# Altium project Lora_low_Power.PrjPcb
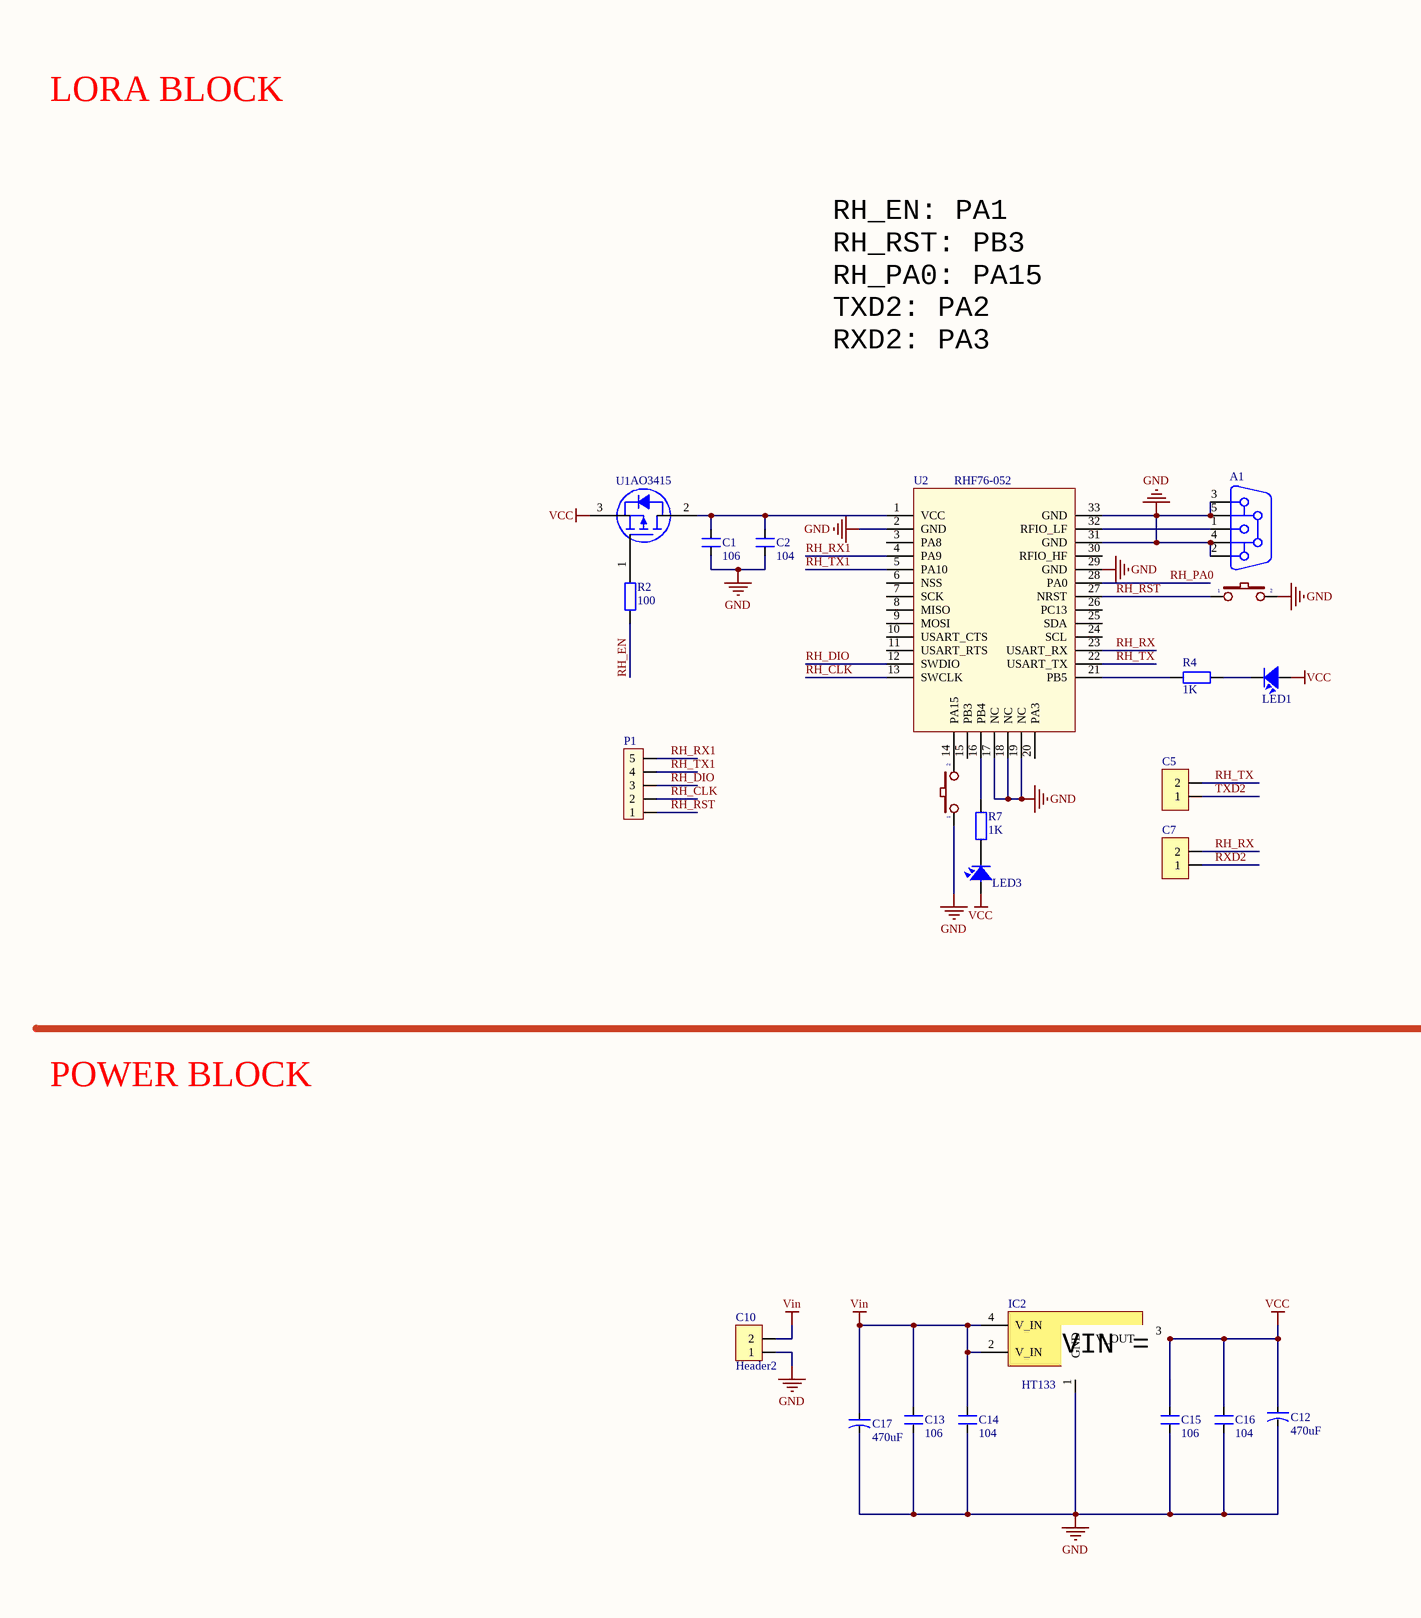
[diagram p0: Sheet2.SchDoc, left]
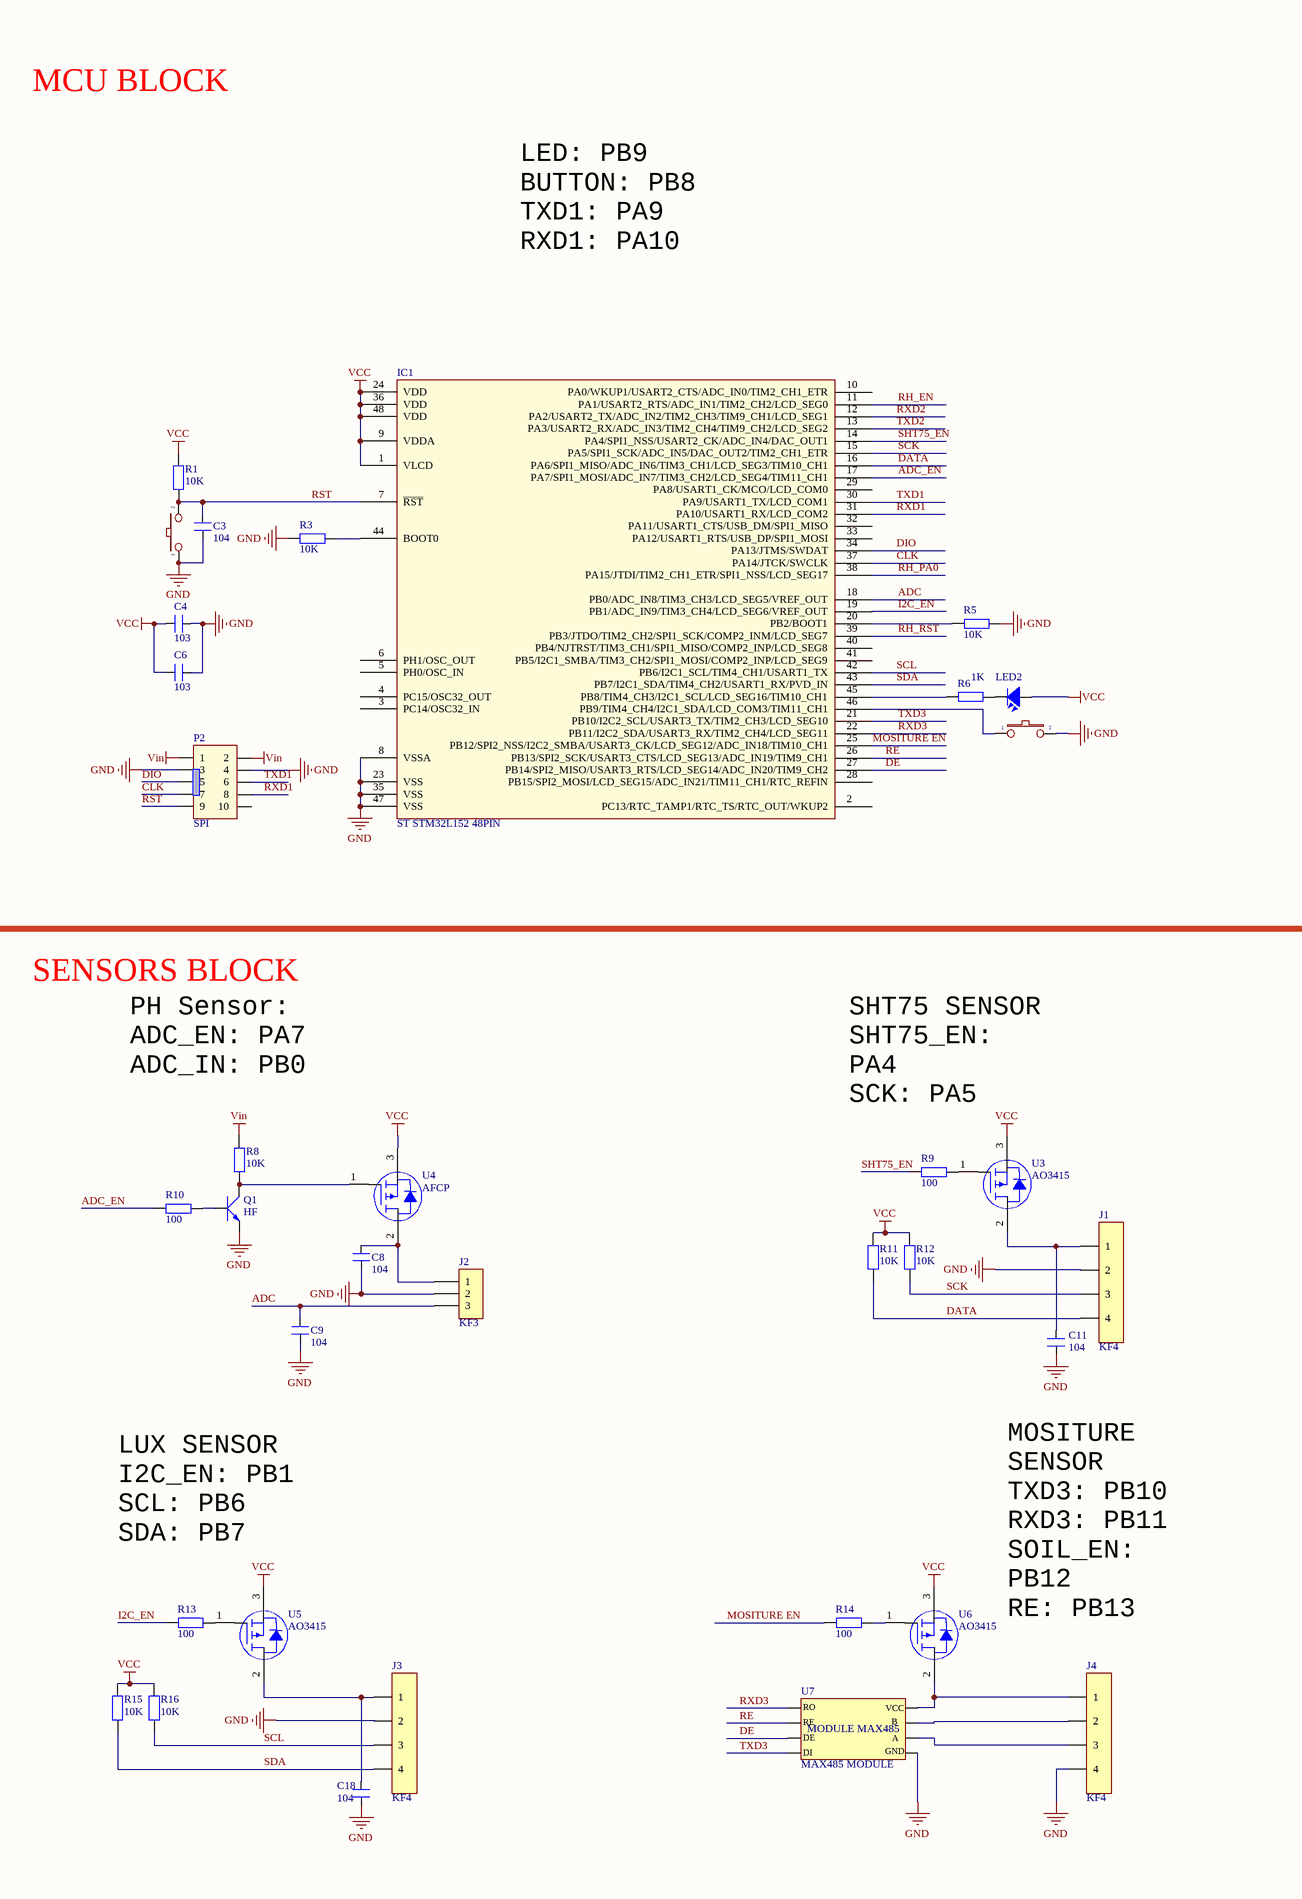
[diagram p1: Sheet2.SchDoc, right]
1 sheet, 58 parts. Net scope: global (net labels, ports and power ports of the same name join across sheets).
Board file: PCB2.PcbDoc

## Sheet Sheet2.SchDoc
size A2

### Parts
A1  (no value)  [SMA-V]
C1  106  [CAP 0805]
C2  104  [CAP 0805]
C3  104  [CAP 0805]
C4  103  [CAP 0805]
C5  JP2  [JP2-CLOSED]  (value not drawn)
C6  103  [CAP 0805]
C7  JP2  [JP2-CLOSED]  (value not drawn)
C8  104  [CAP 0805]
C9  104  [CAP 0805]
C10  Header2  [Header2]
C11  104  [CAP 0805]
C12  470uF  [Tu_Nhom]
C13  106  [CAP 0805]
C14  104  [CAP 0805]
C15  106  [CAP 0805]
C16  104  [CAP 0805]
C17  470uF  [Tu_Nhom]
C18  104  [CAP 0805]
IC1  ST STM32L152 48PIN  [ST LQFP-48 7x7MM]
IC2  HT133  [HT7133]
J1  KF4  [KF4]
J2  KF3  [KF3-5.08T]
J3  KF4  [KF4]
J4  KF4  [KF4]
LED1  LED  [LED 0805]  (value not drawn)
LED2  LED  [Header2]  (value not drawn)
LED3  LED  [LED 0805]  (value not drawn)
P1  JP5  [JP5]  (value not drawn)
P2  SPI  [IDE_2X5]
Q1  HF  [SOT23B]
R1  10K  [RES 0805/2012]
R2  100  [RES 0805/2012]
R3  10K  [RES 0805/2012]
R4  1K  [RES 0805/2012]
R5  10K  [RES 0805/2012]
R6  1K  [RES 0805/2012]
R7  1K  [RES 0805/2012]
R8  10K  [RES 0805/2012]
R9  100  [RES 0805/2012]
R10  100  [RES 0805/2012]
R11  10K  [RES 0805/2012]
R12  10K  [RES 0805/2012]
R13  100  [RES 0805/2012]
R14  100  [RES 0805/2012]
R15  10K  [RES 0805/2012]
R16  10K  [RES 0805/2012]
SW1  LRST  [SW1-SMD]  (value not drawn)
SW2  RST  [Header2]  (value not drawn)
SW3  DFU  [SW1-SMD]  (value not drawn)
SW4  RST  [Header2]  (value not drawn)
U1  AO3415  [SOT23B]
U2  RHF76-052  [RHF76-052]
U3  AO3415  [SOT23B]
U4  AFCP  [SOT23B]
U5  AO3415  [SOT23B]
U6  AO3415  [SOT23B]
U7  MAX485 MODULE  [MODULE MAX485]

### Nets
GND: A1.2 A1.3 A1.4 A1.5 C1.2 C2.1 C3.1 C4.2 C6.2 C8.2 C9.2 C10.1 C11.2 C12.2 C13.2 C14.2 C15.2 C16.2 C17.2 C18.2 IC1.8(VSSA) IC1.23(VSS) IC1.35(VSS) IC1.47(VSS) IC2.1(GND) J1.2 J2.2 J3.2 J4.4 P2.3 P2.4 Q1.1(E) R3.1 R5.2 SW1.2 SW2.1 SW3.1 SW4.2 U2.2(GND) U2.17(NC) U2.18(NC) U2.19(NC) U2.29(GND) U2.31(GND) U2.33(GND) U7.5
VCC: C4.1 C6.1 C12.1 C15.1 C16.1 IC1.1(VLCD) IC1.9(VDDA) IC1.24(VDD) IC1.36(VDD) IC1.48(VDD) IC2.3(V_OUT) LED1.1 LED2.1 LED3.1 R1.2 R11.2 R12.2 R15.2 R16.2 U1.3(S) U3.3(S) U4.3(S) U5.3(S) U6.3(S)
Vin: C10.2 C13.1 C14.1 C17.1 IC2.2(V_IN) IC2.4(V_IN) P2.1 P2.2 R8.2
ADC: C9.1 IC1.18(PB0/ADC_IN8/TIM3_CH3/LCD_SEG5/VREF_OUT) J2.3
ADC_EN: IC1.17(PA7/SPI1_MOSI/ADC_IN7/TIM3_CH2/LCD_SEG4/TIM11_CH1) R10.2
CLK: IC1.37(PA14/JTCK/SWCLK) P2.7
DATA: IC1.16(PA6/SPI1_MISO/ADC_IN6/TIM3_CH1/LCD_SEG3/TIM10_CH1) J1.4 R11.1
DE: IC1.27(PB14/SPI2_MISO/USART3_RTS/LCD_SEG14/ADC_IN20/TIM9_CH2) U7.3
DIO: IC1.34(PA13/JTMS/SWDAT) P2.5
I2C_EN: IC1.19(PB1/ADC_IN9/TIM3_CH4/LCD_SEG6/VREF_OUT) R13.2
MOSITURE EN: IC1.25(PB12/SPI2_NSS/I2C2_SMBA/USART3_CK/LCD_SEG12/ADC_IN18/TIM10_CH1) R14.2
RE: IC1.26(PB13/SPI2_SCK/USART3_CTS/LCD_SEG13/ADC_IN19/TIM9_CH1) U7.2
RH_CLK: P1.2 U2.13(SWCLK)
RH_DIO: P1.3 U2.12(SWDIO)
RH_EN: IC1.11(PA1/USART2_RTS/ADC_IN1/TIM2_CH2/LCD_SEG0) R2.2
RH_PA0: IC1.38(PA15/JTDI/TIM2_CH1_ETR/SPI1_NSS/LCD_SEG17) U2.28(PA0)
RH_RST: IC1.39(PB3/JTDO/TIM2_CH2/SPI1_SCK/COMP2_INM/LCD_SEG7) P1.1 SW1.1 U2.27(NRST)
RH_RX: C7.2 U2.23(USART_RX)
RH_RX1: P1.5 U2.4(PA9)
RH_TX: C5.2 U2.22(USART_TX)
RH_TX1: P1.4 U2.5(PA10)
RST: C3.2 IC1.7(~{RST}) P2.9 R1.1 SW2.2
RXD1: IC1.31(PA10/USART1_RX/LCD_COM2) P2.8
RXD2: C7.1 IC1.12(PA2/USART2_TX/ADC_IN2/TIM2_CH3/TIM9_CH1/LCD_SEG1)
RXD3: IC1.22(PB11/I2C2_SDA/USART3_RX/TIM2_CH4/LCD_SEG11) U7.1
SCK: IC1.15(PA5/SPI1_SCK/ADC_IN5/DAC_OUT2/TIM2_CH1_ETR) J1.3 R12.1
SCL: IC1.42(PB6/I2C1_SCL/TIM4_CH1/USART1_TX) J3.3 R16.1
SDA: IC1.43(PB7/I2C1_SDA/TIM4_CH2/USART1_RX/PVD_IN) J3.4 R15.1
SHT75_EN: IC1.14(PA4/SPI1_NSS/USART2_CK/ADC_IN4/DAC_OUT1) R9.2
TXD1: IC1.30(PA9/USART1_TX/LCD_COM1) P2.6
TXD2: C5.1 IC1.13(PA3/USART2_RX/ADC_IN3/TIM2_CH4/TIM9_CH2/LCD_SEG2)
TXD3: IC1.21(PB10/I2C2_SCL/USART3_TX/TIM2_CH3/LCD_SEG10) U7.4
NetA1_1: A1.1 U2.32(RFIO_LF)
NetC1_1: C1.1 C2.2 U1.2(D) U2.1(VCC)
NetC8_1: C8.1 J2.1 U4.2(D)
NetC11_1: C11.1 J1.1 U3.2(D)
NetC18_1: C18.1 J3.1 U5.2(D)
NetIC1_20: IC1.20(PB2/BOOT1) R5.1
NetIC1_44: IC1.44(BOOT0) R3.2
NetIC1_45: IC1.45(PB8/TIM4_CH3/I2C1_SCL/LCD_SEG16/TIM10_CH1) R6.1
NetIC1_46: IC1.46(PB9/TIM4_CH4/I2C1_SDA/LCD_COM3/TIM11_CH1) SW4.1
NetJ4_1: J4.1 U6.2(D) U7.8
NetJ4_2: J4.2 U7.7
NetJ4_3: J4.3 U7.6
NetLED1_2: LED1.2 R4.2
NetLED2_2: LED2.2 R6.2
NetLED3_2: LED3.2 R7.2
NetQ1_2: Q1.2(C) R8.1 U4.1(G)
NetQ1_3: Q1.3(B) R10.1
NetR2_1: R2.1 U1.1(G)
NetR4_1: R4.1 U2.21(PB5)
NetR7_1: R7.1 U2.16(PB4)
NetR9_1: R9.1 U3.1(G)
NetR13_1: R13.1 U5.1(G)
NetR14_1: R14.1 U6.1(G)
NetSW3_2: SW3.2 U2.14(PA15)

Not connected (* = marked no-connect by the designer): IC1 2(PC13/RTC_TAMP1/RTC_TS/RTC_OUT/WKUP2) 3(PC14/OSC32_IN) 4(PC15/OSC32_OUT) 5(PH0/OSC_IN) 6(PH1/OSC_OUT) 10(PA0/WKUP1/USART2_CTS/ADC_IN0/TIM2_CH1_ETR) 28(PB15/SPI2_MOSI/LCD_SEG15/ADC_IN21/TIM11_CH1/RTC_REFIN) 29(PA8/USART1_CK/MCO/LCD_COM0) 32(PA11/USART1_CTS/USB_DM/SPI1_MISO) 33(PA12/USART1_RTS/USB_DP/SPI1_MOSI) 40(PB4/NJTRST/TIM3_CH1/SPI1_MISO/COMP2_INP/LCD_SEG8) 41(PB5/I2C1_SMBA/TIM3_CH2/SPI1_MOSI/COMP2_INP/LCD_SEG9); P2 10; U2 3(PA8) 6(NSS) 7(SCK) 8(MISO) 9(MOSI) 10(USART_CTS) 11(USART_RTS) 15(PB3) 20(PA3) 24(SCL) 25(SDA) 26(PC13) 30(RFIO_HF)

### Notes on the sheet
- LORA BLOCK
- MCU BLOCK
- RH_EN: PA1
  RH_RST: PB3
  RH_PA0: PA15
  TXD2: PA2
  RXD2: PA3
- LED: PB9
  BUTTON: PB8
  TXD1: PA9
  RXD1: PA10
- POWER BLOCK
- SENSORS BLOCK
- (near R8) PH Sensor:
  ADC_EN: PA7
  ADC_IN: PB0
- SHT75 SENSOR
  SHT75_EN: PA4
  SCK: PA5
  DATA: PA6
- (near IC2) VIN = 5->12VDC
- LUX SENSOR
  I2C_EN: PB1
  SCL: PB6
  SDA: PB7
- MOSITURE SENSOR
  TXD3: PB10
  RXD3: PB11
  SOIL_EN: PB12
  RE: PB13
  DE: PB14
- Title
- Size:
- Date:
- File:
- A2
- Number:
- Time:
- Revision:
- Sheet
- of
- (in symbol MAX485 MODULE) RO; VCC; RE; B; MODULE MAX485; DE; A; DI; GND

### Library data of the parts
A1 = CON Ant: CONNECTOR ANTEN; partNo: 210111003; Manufacturer: Würth Elektronik eiSos GmbH; ComponentLink1Description: Manufacturer; ComponentLink1URL: http://www.we-online.de; Created by: Christin Zierenner; Created Date: May 2012; ComponentLink2Description: Datasheet; ComponentLink2URL: http://katalog.we-online.de/kataloge/eisos/index.php?language=en&pf=Filter_gerade
C1-C3 C8 C9 C11 C13-C16 C18 = CM: Cap SMD; Value: 103
C4 C6 = CM: Cap SMD; Value: 103
C5 C7 = JP2: WR-PHD 2.54 mm Angled Socket Header; Manufacturer: W¨¹rth Elektronik eiSos GmbH; partNo: 613002143121; ComponentLink1 Description: Manufacturer; ComponentLink2 Description: Datasheet; NoPins: 02; Created Date: 29 March 2013; ComponentLink1URL: http://www.we-online.com; ComponentLink2URL: http://katalog.we-online.de/em/datasheet/6130xx143121.pdf; Created by: Karrer Zheng
C10 = Header2: Header IDC, 2 x 1 Pin Vertical 2.54mm Pitch (Non-Boxed, Male); Manufacturer: W¨¹rth Elektronik eiSos GmbH; partNo: 613002143121; ComponentLink1 Description: Manufacturer; ComponentLink2 Description: Datasheet; NoPins: 02; Created Date: 29 March 2013; ComponentLink1URL: http://www.we-online.com; ComponentLink2URL: http://katalog.we-online.de/em/datasheet/6130xx143121.pdf; Created by: Karrer Zheng
C12 C17 = CN-ALU-SMD: Polarized Capacitor (Axial); Published: 8-Jun-2000; LatestRevisionDate: 17-Jul-2002; LatestRevisionNote: Re-released for DXP Platform.; PackageReference: POLAR0.8; Publisher: Altium Limited
  C17: Parameter 1: *
IC2 = HT73XX_1: HT73XX
J1 J3 = KF4: Manufacturer: W¨¹rth Elektronik eiSos GmbH; PartNo: 691133710004; ComponentLink1 Description: Manufacturer; ComponentLink2 Description: Datasheet; NoPins: 4; ComponentLink1 URL: http://www.we-online.com; ComponentLink2 URL: http://katalog.we-online.de/em/datasheet/6911337100xx.pdf; Created By: Baojun Chen; Created Date: 4-Aug-15
J2 = KF3: Manufacturer: Würth Elektronik eiSos GmbH; partNo: 691103110003; ComponentLink1 Description: Manufacturer; ComponentLink2 Description: Datasheet; NoPins: 3; Created Date: 29 October 2013; ComponentLink1URL: http://www.we-online.com; ComponentLink2URL: http://katalog.we-online.de/em/datasheet/6911031100xx.pdf; Created by: Karrer Zheng
J4 = KF4: pin to pad: 1>4 2>3 3>2 4>1; Manufacturer: W¨¹rth Elektronik eiSos GmbH; PartNo: 691133710004; ComponentLink1 Description: Manufacturer; ComponentLink2 Description: Datasheet; NoPins: 4; ComponentLink1 URL: http://www.we-online.com; ComponentLink2 URL: http://katalog.we-online.de/em/datasheet/6911337100xx.pdf; Created By: Baojun Chen; Created Date: 4-Aug-15
LED1-LED3 = LED SMD: Value: LED 3 - 5 ly 2 Colour
P2 = IDE 5x2: Header 5x2; Value: Header 5x2
Q1 = C1815: NPN 600mW, ECB; Value: C1815
R1-R3 R5 R8-R16 = RM: Resistor SMD; Value: 1K
R4 R6 R7 = RM: Resistor SMD; Value: 1K
SW1-SW4 = SW2: Switch button 2 pin; Value: SW chip 2 pin
U1 U3-U6 = AO3415: pin to pad: 1>3 3>1